# Altium schematic sheet SAML21_Xplained_Pro_current_measurement_control.SchDoc: Current measurement control
size A3; Organization: ATMEL Norway; Address1: Vestre Rosten 79; Address2: N-7075 TILLER; Address3: NORWAY; DocumentNumber: A09-2241; Revision: 4; SheetNumber: 7; SheetTotal: 10; PageSetup: Record=PageOptions|CenterHorizontal=True|CenterVertical=True|PrintScale=1.01|XCorrection=1.00|YCorrection=1.00|PrintKind=1|BorderSize=5000000|LeftOffset=0|BottomOffset=0|Orientation=2|PaperLength=1000|PaperWidth=1000|Scale=100|PaperSource=7|PrintQuality=-4|MediaType=1|DitherType=10|PaperKind=A3 (297 x 420 mm)|PrintScaleMode=1
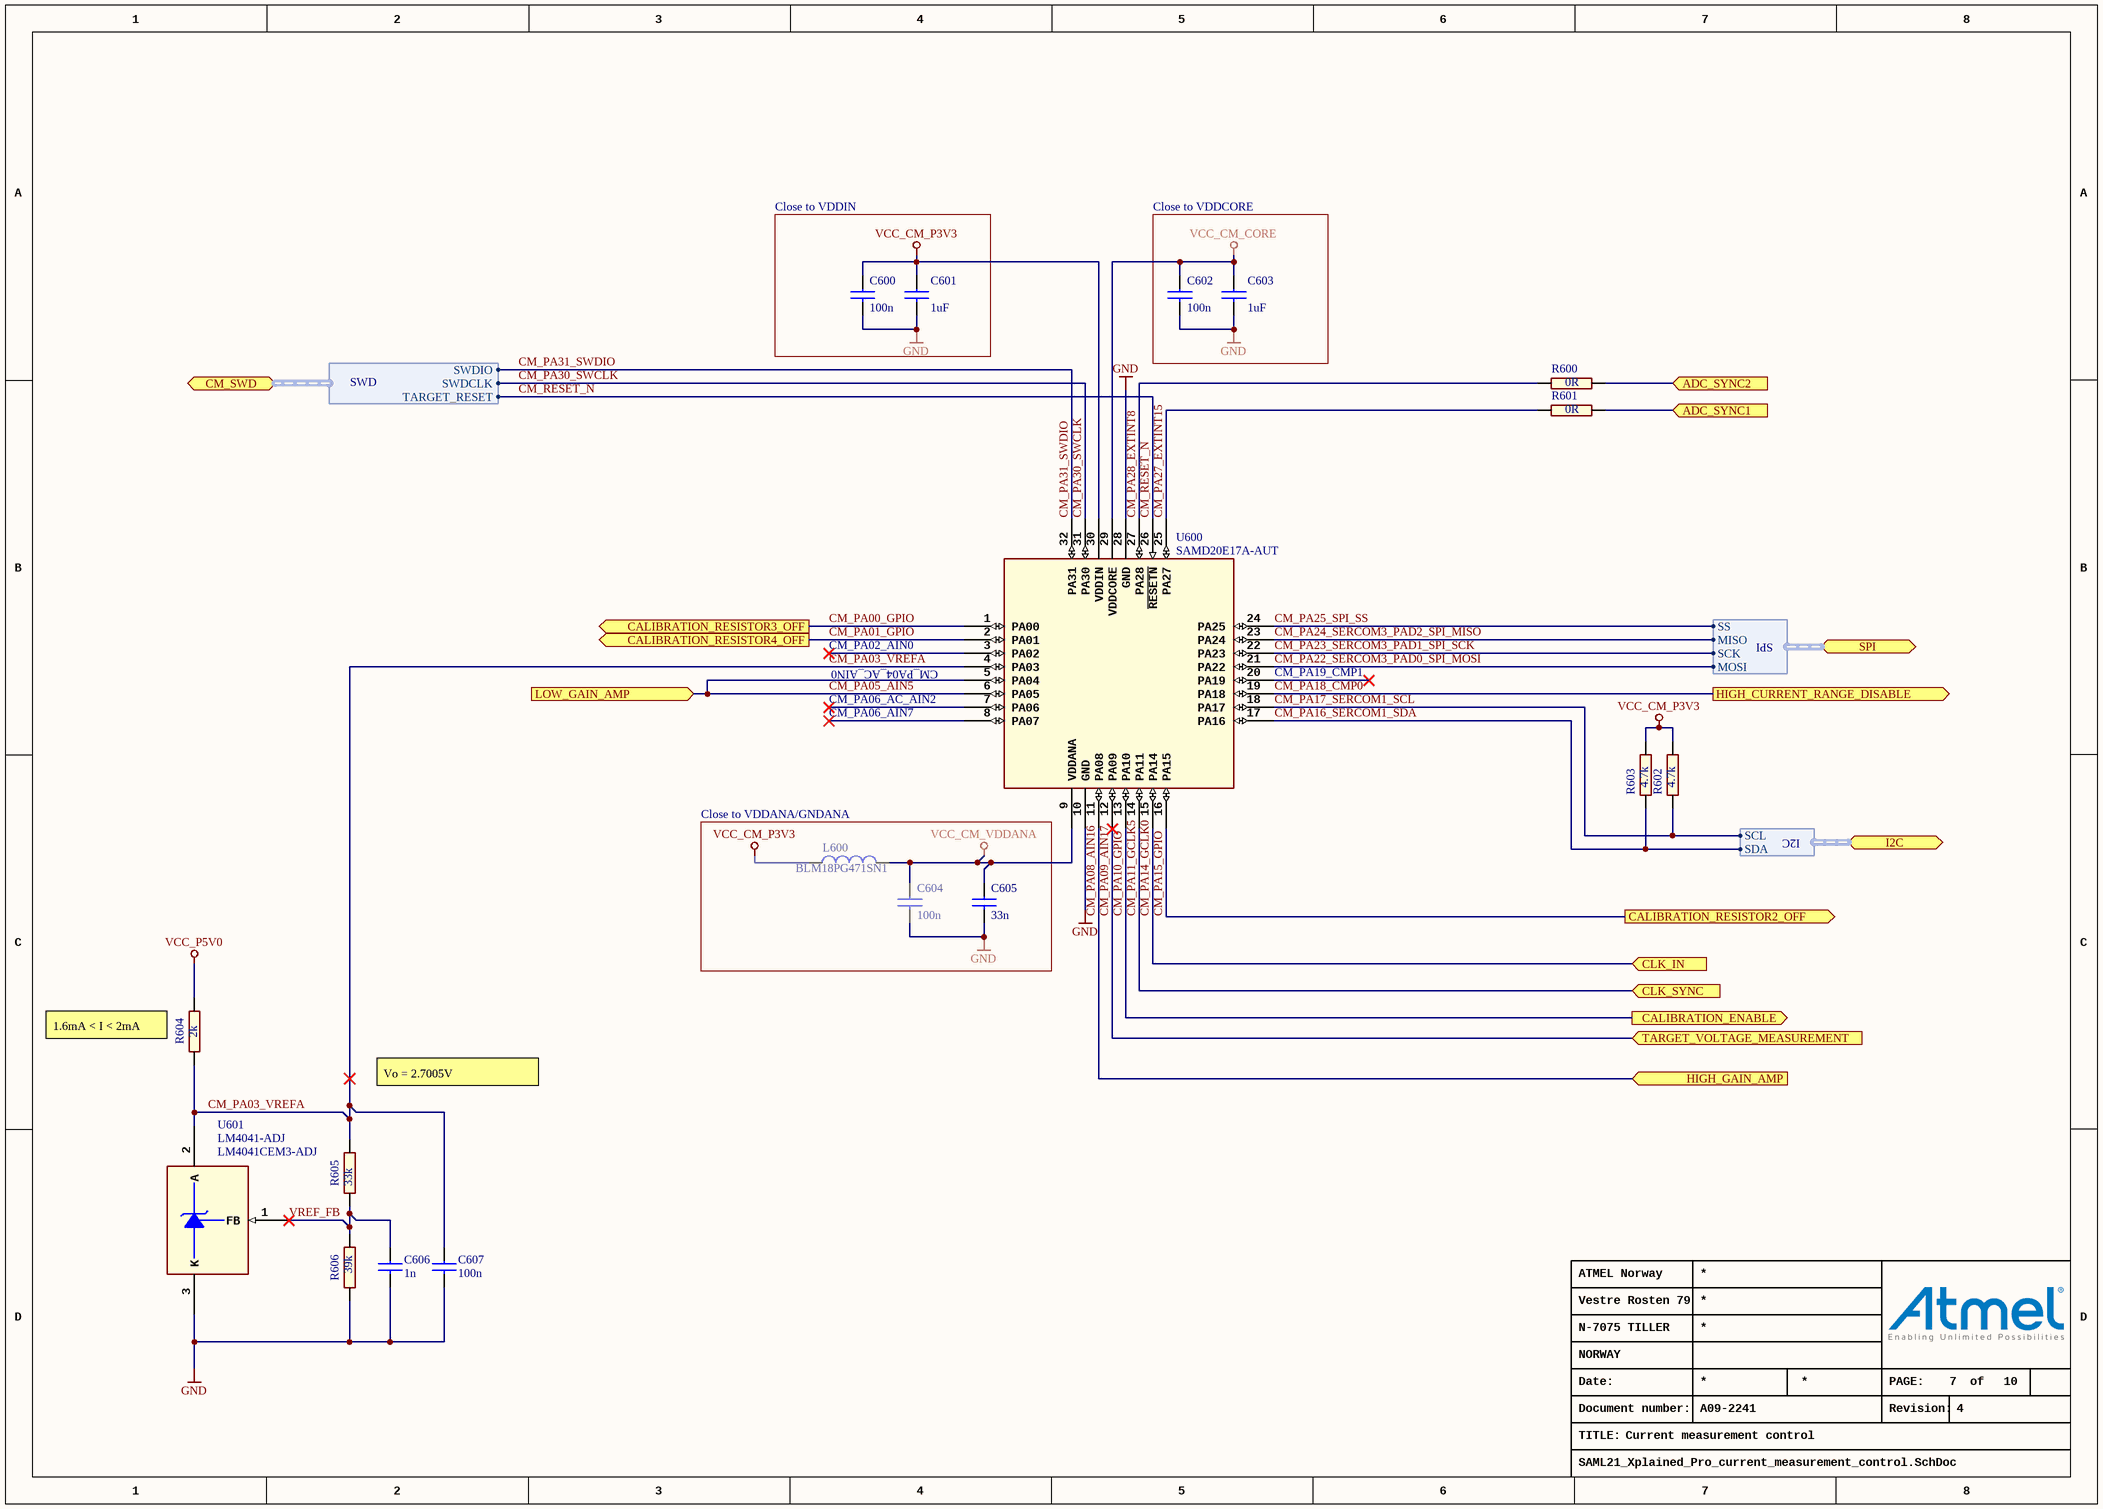
[diagram p0: SAML21_Xplained_Pro_current_measurement_control.SchDoc]

## Parts
C600  value 100n  [AP1-00053]  (hidden comment: CAP-NONPOL)
C601  value 1uF  [AP1-00117]  (hidden comment: CAP-NONPOL)
C602  value 100n  [AP1-00053]  (hidden comment: CAP-NONPOL)
C603  value 1uF  [AP1-00117]  (hidden comment: CAP-NONPOL)
C604  value 100n  [AP1-00053]  (hidden comment: CAP-NONPOL)
C605  value 33n  [AP1-00053]  (hidden comment: CAP-NONPOL)
C606  value 1n  [AP1-00053]  (hidden comment: CAP-NONPOL)
C607  value 100n  [AP1-00053]  (hidden comment: CAP-NONPOL)
L600  BLM18PG471SN1  [AP3-00005]
R600  value 0R  [AP2-00011]  (hidden comment: R2)
R601  value 0R  [AP2-00011]  (hidden comment: R2)
R602  value 4.7k  [AP2-00011]  (hidden comment: R2)
R603  value 4.7k  [AP2-00011]  (hidden comment: R2)
R604  value 2k  [AP2-00011]  (hidden comment: R2)
R605  value 33k  [AP2-00011]  (hidden comment: R2)
R606  value 39k  [AP2-00011]  (hidden comment: R2)
U600  value SAMD20E17A-AUT  [AP6-00061]  (hidden comment: SAMD20E)
U601  LM4041-ADJ  value LM4041CEM3-ADJ  [AP5-00002]

## Blocks framed on the sheet
Close to VDDIN: C600 C601
Close to VDDCORE: C602 C603
Close to VDDANA/GNDANA: C604 C605 L600

## Ports
ADC_SYNC1 (in), ADC_SYNC2 (in), CALIBRATION_ENABLE (out), CALIBRATION_RESISTOR2_OFF (out), CALIBRATION_RESISTOR3_OFF (out), CALIBRATION_RESISTOR4_OFF (out), CLK_IN (in), CLK_SYNC (in), CM_SWD (harness SWD), HIGH_CURRENT_RANGE_DISABLE (out), HIGH_GAIN_AMP (in), I2C (harness I2C), LOW_GAIN_AMP (in), SPI (harness SPI), TARGET_VOLTAGE_MEASUREMENT (in)

## Harnesses
SPI: MISO, MOSI, SCK, SS
I2C: SCL, SDA
SWD: SWDCLK, SWDIO, TARGET_RESET

## Nets
GND: C600.2 C601.2 C602.2 C603.2 C604.2 C605.2 C606.2 C607.2 R606.1 U600.10(GND) U600.28(GND) U601.3(K)
VCC_CM_CORE: C602.1 C603.1 U600.29(VDDCORE)
VCC_CM_P3V3: C600.1 C601.1 L600.1 R602.2 R603.2 U600.30(VDDIN)
VCC_CM_VDDANA: C604.1 C605.1 L600.2 U600.9(VDDANA)
VCC_P5V0: R604.2
ADC_SYNC1: R601.2 ; port ADC_SYNC1
ADC_SYNC2: R600.2 ; port ADC_SYNC2
CM_PA00_GPIO: U600.1(PA00) ; port CALIBRATION_RESISTOR3_OFF
CM_PA01_GPIO: U600.2(PA01) ; port CALIBRATION_RESISTOR4_OFF
CM_PA03_VREFA: C607.1 R604.1 R605.2 U600.4(PA03) U601.2(A)
CM_PA05_AIN5: U600.5(PA04) U600.6(PA05) ; port LOW_GAIN_AMP
CM_PA08_AIN16: U600.11(PA08) ; port HIGH_GAIN_AMP
CM_PA09_AIN17: U600.12(PA09) ; port TARGET_VOLTAGE_MEASUREMENT
CM_PA10_GPIO: U600.13(PA10) ; port CALIBRATION_ENABLE
CM_PA11_GCLK5: U600.14(PA11) ; port CLK_SYNC
CM_PA14_GCLK0: U600.15(PA14) ; port CLK_IN
CM_PA15_GPIO: U600.16(PA15) ; port CALIBRATION_RESISTOR2_OFF
CM_PA16_SERCOM1_SDA: R603.1 U600.17(PA16) ; port I2C.SDA
CM_PA17_SERCOM1_SCL: R602.1 U600.18(PA17) ; port I2C.SCL
CM_PA18_CMP0: U600.19(PA18) ; port HIGH_CURRENT_RANGE_DISABLE
CM_PA22_SERCOM3_PAD0_SPI_MOSI: U600.21(PA22) ; port SPI.MOSI
CM_PA23_SERCOM3_PAD1_SPI_SCK: U600.22(PA23) ; port SPI.SCK
CM_PA24_SERCOM3_PAD2_SPI_MISO: U600.23(PA24) ; port SPI.MISO
CM_PA25_SPI_SS: U600.24(PA25) ; port SPI.SS
CM_PA27_EXTINT15: R601.1 U600.25(PA27)
CM_PA28_EXTINT8: R600.1 U600.27(PA28)
CM_PA30_SWCLK: U600.31(PA30) ; port CM_SWD.SWDCLK
CM_PA31_SWDIO: U600.32(PA31) ; port CM_SWD.SWDIO
CM_RESET_N: U600.26(~{RESETN}) ; port CM_SWD.TARGET_RESET
VREF_FB: C606.1 R605.1 R606.2 U601.1(FB)

Not connected (* = marked no-connect by the designer): U600 3(PA02)* 7(PA06)* 8(PA07)* 20(PA19)*

## Notes on the sheet
- CM_PA02_AIN0
- CM_PA06_AIN7
- CM_PA06_AC_AIN2
- CM_PA04_AC_AIN0
- (near U600) CM_PA19_CMP1
- (near R604) 1.6mA < I < 2mA
- Vo = 2.7005V
- Date:
- PAGE:
- of
- TITLE:
- Document number:
- Revision:

## Library data of the parts
C600 C602 C604 C607 = A01-0246: Ceramic capacitor, SMD 0402, X7R, 16V, +/-10%; PartGroup: Capacitors,Ceramic,SMD 0402; Manufacturer: Kemet; MPN: C0402C104K4RACTU; TemperatureRange: -55 - +125 deg C; AN: A01-0246; Tolerance: 16V, +/-10%; Height: 0,5
C601 C603 = A01-0368: Ceramic capacitor, SMD 0603, X5R, 25V, ±10%; PartGroup: Capacitors,Ceramic,SMD 0603; Manufacturer: Murata; MPN: GRM188R61E105K; AN: A01-0368; Tolerance: ±10%; Height: 0.800000011920929
C605 = A01-0397: Ceramic capacitor, SMD 0402, X7R, 25V, ±10%; PartGroup: Capacitors,Ceramic,SMD 0402; Manufacturer: Murata; MPN: GRM155R71E333KA88D; Tolerance: ±10%(K); TemperatureRange: -55 to 125°C; AN: A01-0397; Height: 0.5
C606 = A01-0038: Ceramic capacitor, SMD 0402, X7R, 50V, +/-10%; PartGroup: Capacitors,Ceramic,SMD 0402; TemperatureRange: -55 - +125 deg C; AN: A01-0038; Tolerance: 50V, +/-10%; Height: 0,550000011920929
L600 = A03-0035: SMD RF inductor 0603. Z=470Ohm (@100MHz), Max R(dc)=0.65Ohm, Max current=1A; PartGroup: Inductors,EMI; Manufacturer: Murata; Tolerance: ±25%; TemperatureRange: -55°C to +125°C; AN: A03-0035; Value: BLM18PG471SN1; Height: 0,800000011920929; MPN: BLM18PG471SN1
R600 R601 = A02-0163: RES 0.0 OHM 1/16W 0402 SMD; PartGroup: Resistors,SMD,0402 1%; Manufacturer: (n/a); MPN: RMCF0402ZT0R00; Tolerance: 1 %; TemperatureRange: -55 - +125 deg C; AN: A02-0163; Height: 0.349999994039536
R602 R603 = A02-0228: Thick film resistor, SMD 0402, 1/16W, 1%; PartGroup: Resistors,SMD,0402 1%; TemperatureRange: -55 - +125 deg C; AN: A02-0228; Tolerance: 1 %; Height: 0.349999994039536
R604 = A02-0219: Thick film resistor, SMD 0402, 1/16W, 1%; PartGroup: Resistors,SMD,0402 1%; TemperatureRange: -55 - +125 deg C; AN: A02-0219; Tolerance: 1 %; Height: 0,349999994039536
R605 = A02-0248: Thick film resistor, SMD 0402, 1/16W, 1%; PartGroup: Resistors,SMD,0402 1%; TemperatureRange: -55 - +125 deg C; AN: A02-0248; Tolerance: 1 %; Height: 0,349999994039536
R606 = A02-0250: Thick film resistor, SMD 0402, 1/16W, 1%; PartGroup: Resistors,SMD,0402 1%; TemperatureRange: -55 - +125 deg C; AN: A02-0250; Tolerance: 1 %; Height: 0,349999994039536
U600 = A06-1023: Atmel 32bit RISC MCU 32 pin; PartGroup: Integrated Circuits,MCU, MPU, DSP,ARM MCU; MPN: ATSAMD20E17A-AUT; Design comment: *; AN: A06-1023; Height: 1.20000004768372; Manufacturer: ATMEL
U601 = A06-0123: Adjustable shunt voltage regulator, 1.24 to 10V out; PartGroup: Integrated Circuits,Regulators,Voltage reference; Manufacturer: National Semiconductor; TemperatureRange: -40 to +85 deg. C; AN: A06-0123; Height: 1; MPN: LM4041CEM3-ADJ